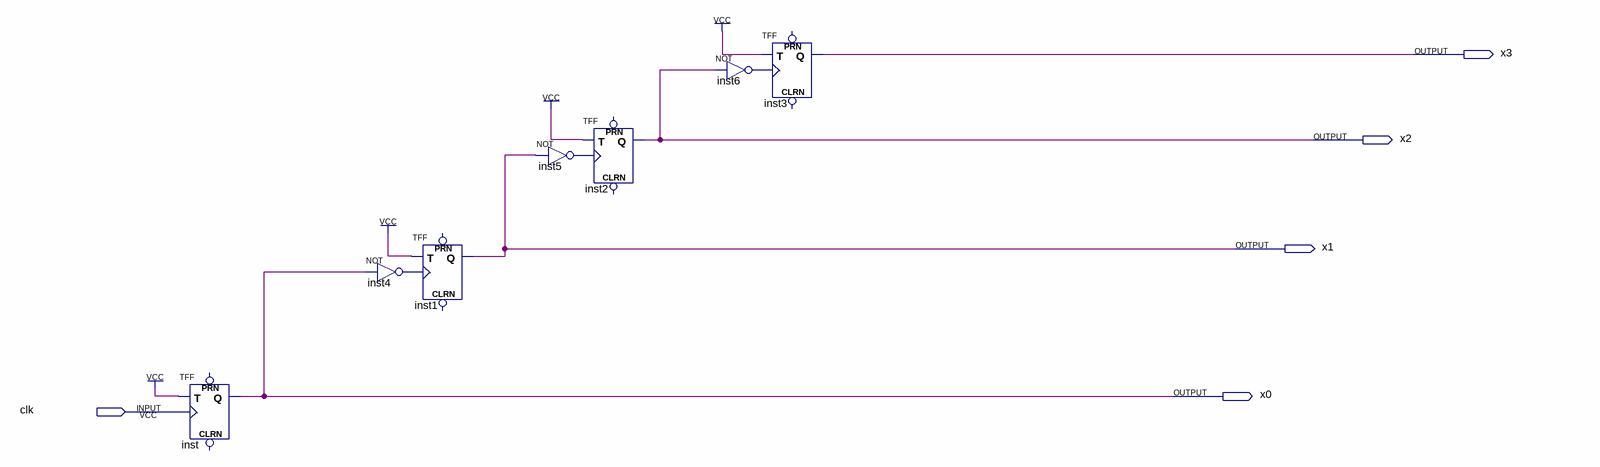
[diagram p0: schematic sheet]
// Quartus schematic zegar.bdf as structural Verilog: 7 symbols, 5 pins
module zegar (
  input  clk,
  output x3,
  output x2,
  output x1,
  output x0
);

  wire inst4_out, inst5_out, inst6_out;

  TFF inst (.T(1'b1), .CLK(clk), .Q(x0));  // open: PRN, CLRN
  not inst4 (inst4_out, x0);
  TFF inst1 (.T(1'b1), .CLK(inst4_out), .Q(x1));  // open: PRN, CLRN
  not inst5 (inst5_out, x1);
  TFF inst2 (.T(1'b1), .CLK(inst5_out), .Q(x2));  // open: PRN, CLRN
  TFF inst3 (.T(1'b1), .CLK(inst6_out), .Q(x3));  // open: PRN, CLRN
  not inst6 (inst6_out, x2);
endmodule
